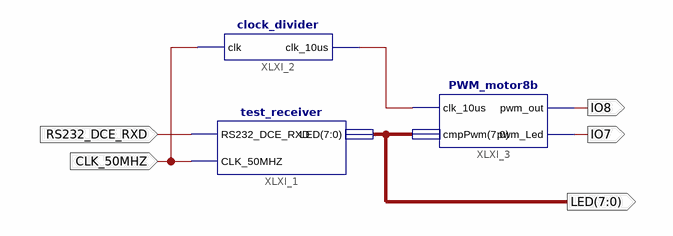
[diagram p0: schematic sheet 1]
// Xilinx ISE schematic test_PWM_servo.sch (spartan3e) as structural Verilog: 3 symbols, 5 ports
module test_PWM_servo (
  input  RS232_DCE_RXD,
  input  CLK_50MHZ,
  output IO8,
  output IO7,
  output [7:0] LED
);

  wire XLXN_5;

  test_receiver XLXI_1 (.RS232_DCE_RXD(RS232_DCE_RXD), .CLK_50MHZ(CLK_50MHZ), .LED(LED));
  clock_divider XLXI_2 (.clk(CLK_50MHZ), .clk_10us(XLXN_5));
  PWM_motor8b XLXI_3 (.clk_10us(XLXN_5), .cmpPwm(LED), .pwm_out(IO8), .pwm_Led(IO7));
endmodule
